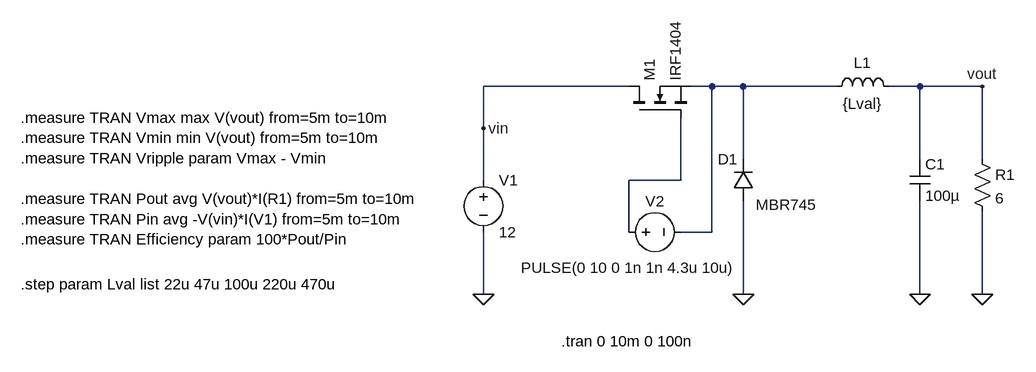
[diagram p0: schematic Buck dc coverter.asc]
Buck dc coverter.asc, the LTspice schematic file:
Version 4.1
SHEET 1 880 680
WIRE -240 -384 -464 -384
WIRE -112 -384 -144 -384
WIRE -64 -384 -112 -384
WIRE 80 -384 -64 -384
WIRE 208 -384 160 -384
WIRE 304 -384 208 -384
WIRE -464 -320 -464 -384
WIRE -64 -272 -64 -384
WIRE 208 -272 208 -384
WIRE 304 -272 304 -384
WIRE -464 -240 -464 -320
WIRE -160 -240 -160 -336
WIRE -160 -240 -240 -240
WIRE -240 -160 -240 -240
WIRE -112 -160 -112 -384
WIRE -112 -160 -160 -160
WIRE -464 -64 -464 -160
WIRE -64 -64 -64 -208
WIRE 208 -64 208 -208
WIRE 304 -64 304 -192
FLAG -464 -64 0
FLAG -64 -64 0
FLAG 208 -64 0
FLAG 304 -64 0
FLAG -464 -320 vin
FLAG 304 -384 vout
SYMBOL voltage -464 -256 R0
WINDOW 123 0 0 Left 0
WINDOW 39 0 0 Left 0
SYMATTR InstName V1
SYMATTR Value 12
SYMBOL nmos -240 -336 R270
SYMATTR InstName M1
SYMATTR Value IRF1404
SYMBOL diode -48 -208 R180
WINDOW 0 24 64 Left 2
WINDOW 3 -97 -6 Left 2
SYMATTR InstName D1
SYMATTR Value MBR745
SYMBOL ind 64 -368 R270
WINDOW 0 37 56 VTop 2
WINDOW 3 5 56 VBottom 2
SYMATTR InstName L1
SYMATTR Value {Lval}
SYMBOL cap 192 -272 R0
SYMATTR InstName C1
SYMATTR Value 100µ
SYMBOL res 288 -288 R0
SYMATTR InstName R1
SYMATTR Value 6
SYMBOL voltage -256 -160 R270
WINDOW 0 32 56 VTop 2
WINDOW 3 -39 15 VBottom 2
WINDOW 123 0 0 Left 0
WINDOW 39 0 0 Left 0
SYMATTR InstName V2
SYMATTR Value PULSE(0 10 0 1n 1n 4.3u 10u)
TEXT -344 8 Left 2 !.tran 0 10m 0 100n
TEXT -1176 -336 Left 2 !.measure TRAN Vmax max V(vout) from=5m to=10m\n.measure TRAN Vmin min V(vout) from=5m to=10m\n.measure TRAN Vripple param Vmax - Vmin\n \n.measure TRAN Pout avg V(vout)*I(R1) from=5m to=10m\n.measure TRAN Pin avg -V(vin)*I(V1) from=5m to=10m\n.measure TRAN Efficiency param 100*Pout/Pin
TEXT -1176 -80 Left 2 !.step param Lval list 22u 47u 100u 220u 470u

The netlist it stands for:
* Buck dc coverter.asc
V1 vin 0 12
M1 vin N002 N001 N001 IRF1404
D1 0 N001 MBR745
L1 N001 vout {Lval}
C1 vout 0 100µ
R1 vout 0 6
V2 N002 N001 PULSE(0 10 0 1n 1n 4.3u 10u)
.model D D
.lib standard.dio
.model NMOS NMOS
.model PMOS PMOS
.lib standard.mos
.tran 0 10m 0 100n
.measure TRAN Vmax max V(vout) from=5m to=10m
.measure TRAN Vmin min V(vout) from=5m to=10m
.measure TRAN Vripple param Vmax - Vmin
.measure TRAN Pout avg V(vout)*I(R1) from=5m to=10m
.measure TRAN Pin avg -V(vin)*I(V1) from=5m to=10m
.measure TRAN Efficiency param 100*Pout/Pin
.step param Lval list 22u 47u 100u 220u 470u
.backanno
.end